# EAGLE schematic v001 (EAGLE 6.4)
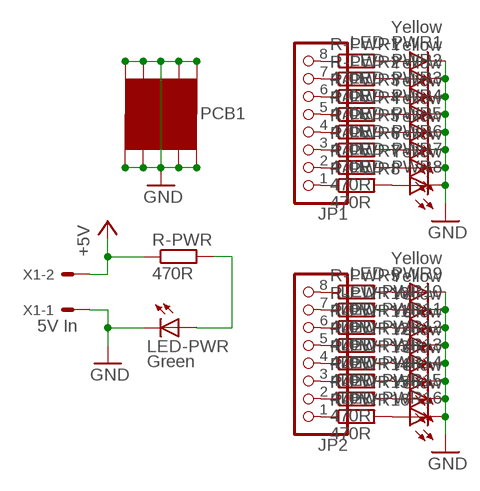
[diagram p0: schematic, sheet 1]

## Parts
JP1  PINHD-1X8  [1X08]
JP2  PINHD-1X8  [1X08]
LED-PWR  Green  LED3MM  [LED3MM]
LED-PWR1  Yellow  LED3MM  [LED3MM]
LED-PWR2  Yellow  LED3MM  [LED3MM]
LED-PWR3  Yellow  LED3MM  [LED3MM]
LED-PWR4  Yellow  LED3MM  [LED3MM]
LED-PWR5  Yellow  LED3MM  [LED3MM]
LED-PWR6  Yellow  LED3MM  [LED3MM]
LED-PWR7  Yellow  LED3MM  [LED3MM]
LED-PWR8  Yellow  LED3MM  [LED3MM]
LED-PWR9  Yellow  LED3MM  [LED3MM]
LED-PWR10  Yellow  LED3MM  [LED3MM]
LED-PWR11  Yellow  LED3MM  [LED3MM]
LED-PWR12  Yellow  LED3MM  [LED3MM]
LED-PWR13  Yellow  LED3MM  [LED3MM]
LED-PWR14  Yellow  LED3MM  [LED3MM]
LED-PWR15  Yellow  LED3MM  [LED3MM]
LED-PWR16  Yellow  LED3MM  [LED3MM]
PCB1  PCB05X05  [PCB_05X05]
R-PWR  470R  R-EU_0204/7  [0204/7]
R-PWR1  470R  R-EU_0204/7  [0204/7]
R-PWR2  470R  R-EU_0204/7  [0204/7]
R-PWR3  470R  R-EU_0204/7  [0204/7]
R-PWR4  470R  R-EU_0204/7  [0204/7]
R-PWR5  470R  R-EU_0204/7  [0204/7]
R-PWR6  470R  R-EU_0204/7  [0204/7]
R-PWR7  470R  R-EU_0204/7  [0204/7]
R-PWR8  470R  R-EU_0204/7  [0204/7]
R-PWR9  470R  R-EU_0204/7  [0204/7]
R-PWR10  470R  R-EU_0204/7  [0204/7]
R-PWR11  470R  R-EU_0204/7  [0204/7]
R-PWR12  470R  R-EU_0204/7  [0204/7]
R-PWR13  470R  R-EU_0204/7  [0204/7]
R-PWR14  470R  R-EU_0204/7  [0204/7]
R-PWR15  470R  R-EU_0204/7  [0204/7]
R-PWR16  470R  R-EU_0204/7  [0204/7]
X1  5V In  22-27-2021-02  [6410-02]

## Nets
+5V: R-PWR.1 X1.2
GND: LED-PWR1.K(C) LED-PWR2.K(C) LED-PWR3.K(C) LED-PWR4.K(C) LED-PWR5.K(C) LED-PWR6.K(C) LED-PWR7.K(C) LED-PWR8.K(C) LED-PWR9.K(C) LED-PWR10.K(C) LED-PWR11.K(C) LED-PWR12.K(C) LED-PWR13.K(C) LED-PWR14.K(C) LED-PWR15.K(C) LED-PWR16.K(C) LED-PWR.K(C) PCB1.GND@1(GND) PCB1.GND@2(GND) PCB1.GND@3(GND) PCB1.GND@4(GND) PCB1.GND@5(GND) PCB1.GND@6(GND) PCB1.GND@7(GND) PCB1.GND@8(GND) X1.1
N$1: JP1.8 R-PWR1.1
N$2: JP1.7 R-PWR2.1
N$3: LED-PWR.A R-PWR.2
N$4: JP1.6 R-PWR3.1
N$5: JP1.5 R-PWR4.1
N$6: JP1.4 R-PWR5.1
N$7: JP1.3 R-PWR6.1
N$8: JP1.2 R-PWR7.1
N$9: JP1.1 R-PWR8.1
N$10: LED-PWR1.A R-PWR1.2
N$11: LED-PWR2.A R-PWR2.2
N$12: LED-PWR3.A R-PWR3.2
N$13: LED-PWR4.A R-PWR4.2
N$14: LED-PWR5.A R-PWR5.2
N$15: LED-PWR6.A R-PWR6.2
N$16: LED-PWR7.A R-PWR7.2
N$17: LED-PWR8.A R-PWR8.2
N$18: JP2.8 R-PWR9.1
N$19: JP2.7 R-PWR10.1
N$20: JP2.6 R-PWR11.1
N$21: JP2.5 R-PWR12.1
N$22: JP2.4 R-PWR13.1
N$23: JP2.3 R-PWR14.1
N$24: JP2.2 R-PWR15.1
N$25: JP2.1 R-PWR16.1
N$26: LED-PWR9.A R-PWR9.2
N$27: LED-PWR10.A R-PWR10.2
N$28: LED-PWR11.A R-PWR11.2
N$29: LED-PWR12.A R-PWR12.2
N$30: LED-PWR13.A R-PWR13.2
N$31: LED-PWR14.A R-PWR14.2
N$32: LED-PWR15.A R-PWR15.2
N$33: LED-PWR16.A R-PWR16.2

## Library data of the parts
JP1 JP2 = pinhead:PINHD-1X8: PIN HEADER
LED-PWR LED-PWR1-LED-PWR16 = led:LED: LED OSRAM: - CHIPLED LG R971, LG N971, LY N971, LG Q971, LY Q971, LO R971, LY R971 LH N974, LH R974 LS Q976, LO Q976, LY Q976 LO Q996 - Hyper CHIPLED LW Q18S LB Q993, LB Q99A, LB R99A - SideLED LS A670, LO A670, LY A670, LG A670, LP A670 LB A673, LV A673, LT A673, LW A673 LH A674 LY A675 LS A676, LA A676, LO A676, LY A676, LW A676 LS A679, LY A679, LG A679 - Hyper Micro SIDELED® LS Y876, LA Y876, LO Y876, LY Y876 LT Y87S - SmartLED LW L88C, LW L88S LB L89C, LB L89S, LG L890 LS L89K, LO L89K, LY L89K LS L896, LA L896, LO L896, LY L896 - TOPLED LS T670, LO T670, LY T670, LG T670, LP T670 LSG T670, LSP T670, LSY T670, LOP T670, LYG T670 LG T671, LOG T671, LSG T671 LB T673, LV T673, LT T673, LW T673 LH T674 LS T676, LA T676, LO T676, LY T676, LB T676, LH T676, LSB T676, LW T676 LB T67C, LV T67C, LT T67C, LS T67K, LO T67K, LY T67K, LW E67C LS E67B, LA E67B, LO E67B, LY E67B, LB E67C, LV E67C, LT E67C LW T67C LS T679, LY T679, LG T679 LS T770, LO T770, LY T770, LG T770, LP T770 LB T773, LV T773, LT T773, LW T773 LH T774 LS E675, LA E675, LY E675, LS T675 LS T776, LA T776, LO T776, LY T776, LB T776 LHGB T686 LT T68C, LB T68C - Hyper Mini TOPLED® LB M676 - Mini TOPLED Santana® LG M470 LS M47K, LO M47K, LY M47K Source: http://www.osram.convergy.de LUXEON: - LUMILED® LXK2-PW12-R00, LXK2-PW12-S00, LXK2-PW14-U00, LXK2-PW14-V00 LXK2-PM12-R00, LXK2-PM12-S00, LXK2-PM14-U00 LXK2-PE12-Q00, LXK2-PE12-R00, LXK2-PE12-S00, LXK2-PE14-T00, LXK2-PE14-U00 LXK2-PB12-K00, LXK2-PB12-L00, LXK2-PB12-M00, LXK2-PB14-N00, LXK2-PB14-P00, LXK2-PB14-Q00 LXK2-PR12-L00, LXK2-PR12-M00, LXK2-PR14-Q00, LXK2-PR14-R00 LXK2-PD12-Q00, LXK2-PD12-R00, LXK2-PD12-S00 LXK2-PH12-R00, LXK2-PH12-S00 LXK2-PL12-P00, LXK2-PL12-Q00, LXK2-PL12-R00 Source: www.luxeon.com KINGBRIGHT: KA-3528ASYC Source: www.kingbright.com
PCB1 = GNLib:PCB
R-PWR R-PWR1-R-PWR16 = rcl:R-EU_: RESISTOR, European symbol
X1 = con-molex:22-?-02: CONNECTOR wire to board 2.54 mm (.1 inch) pitch header; OC_FARNELL: unknown; OC_NEWARK: unknown